# Altium project AJMG 2550XD Silver Jubilee.PrjPcb (part 1 of 2)
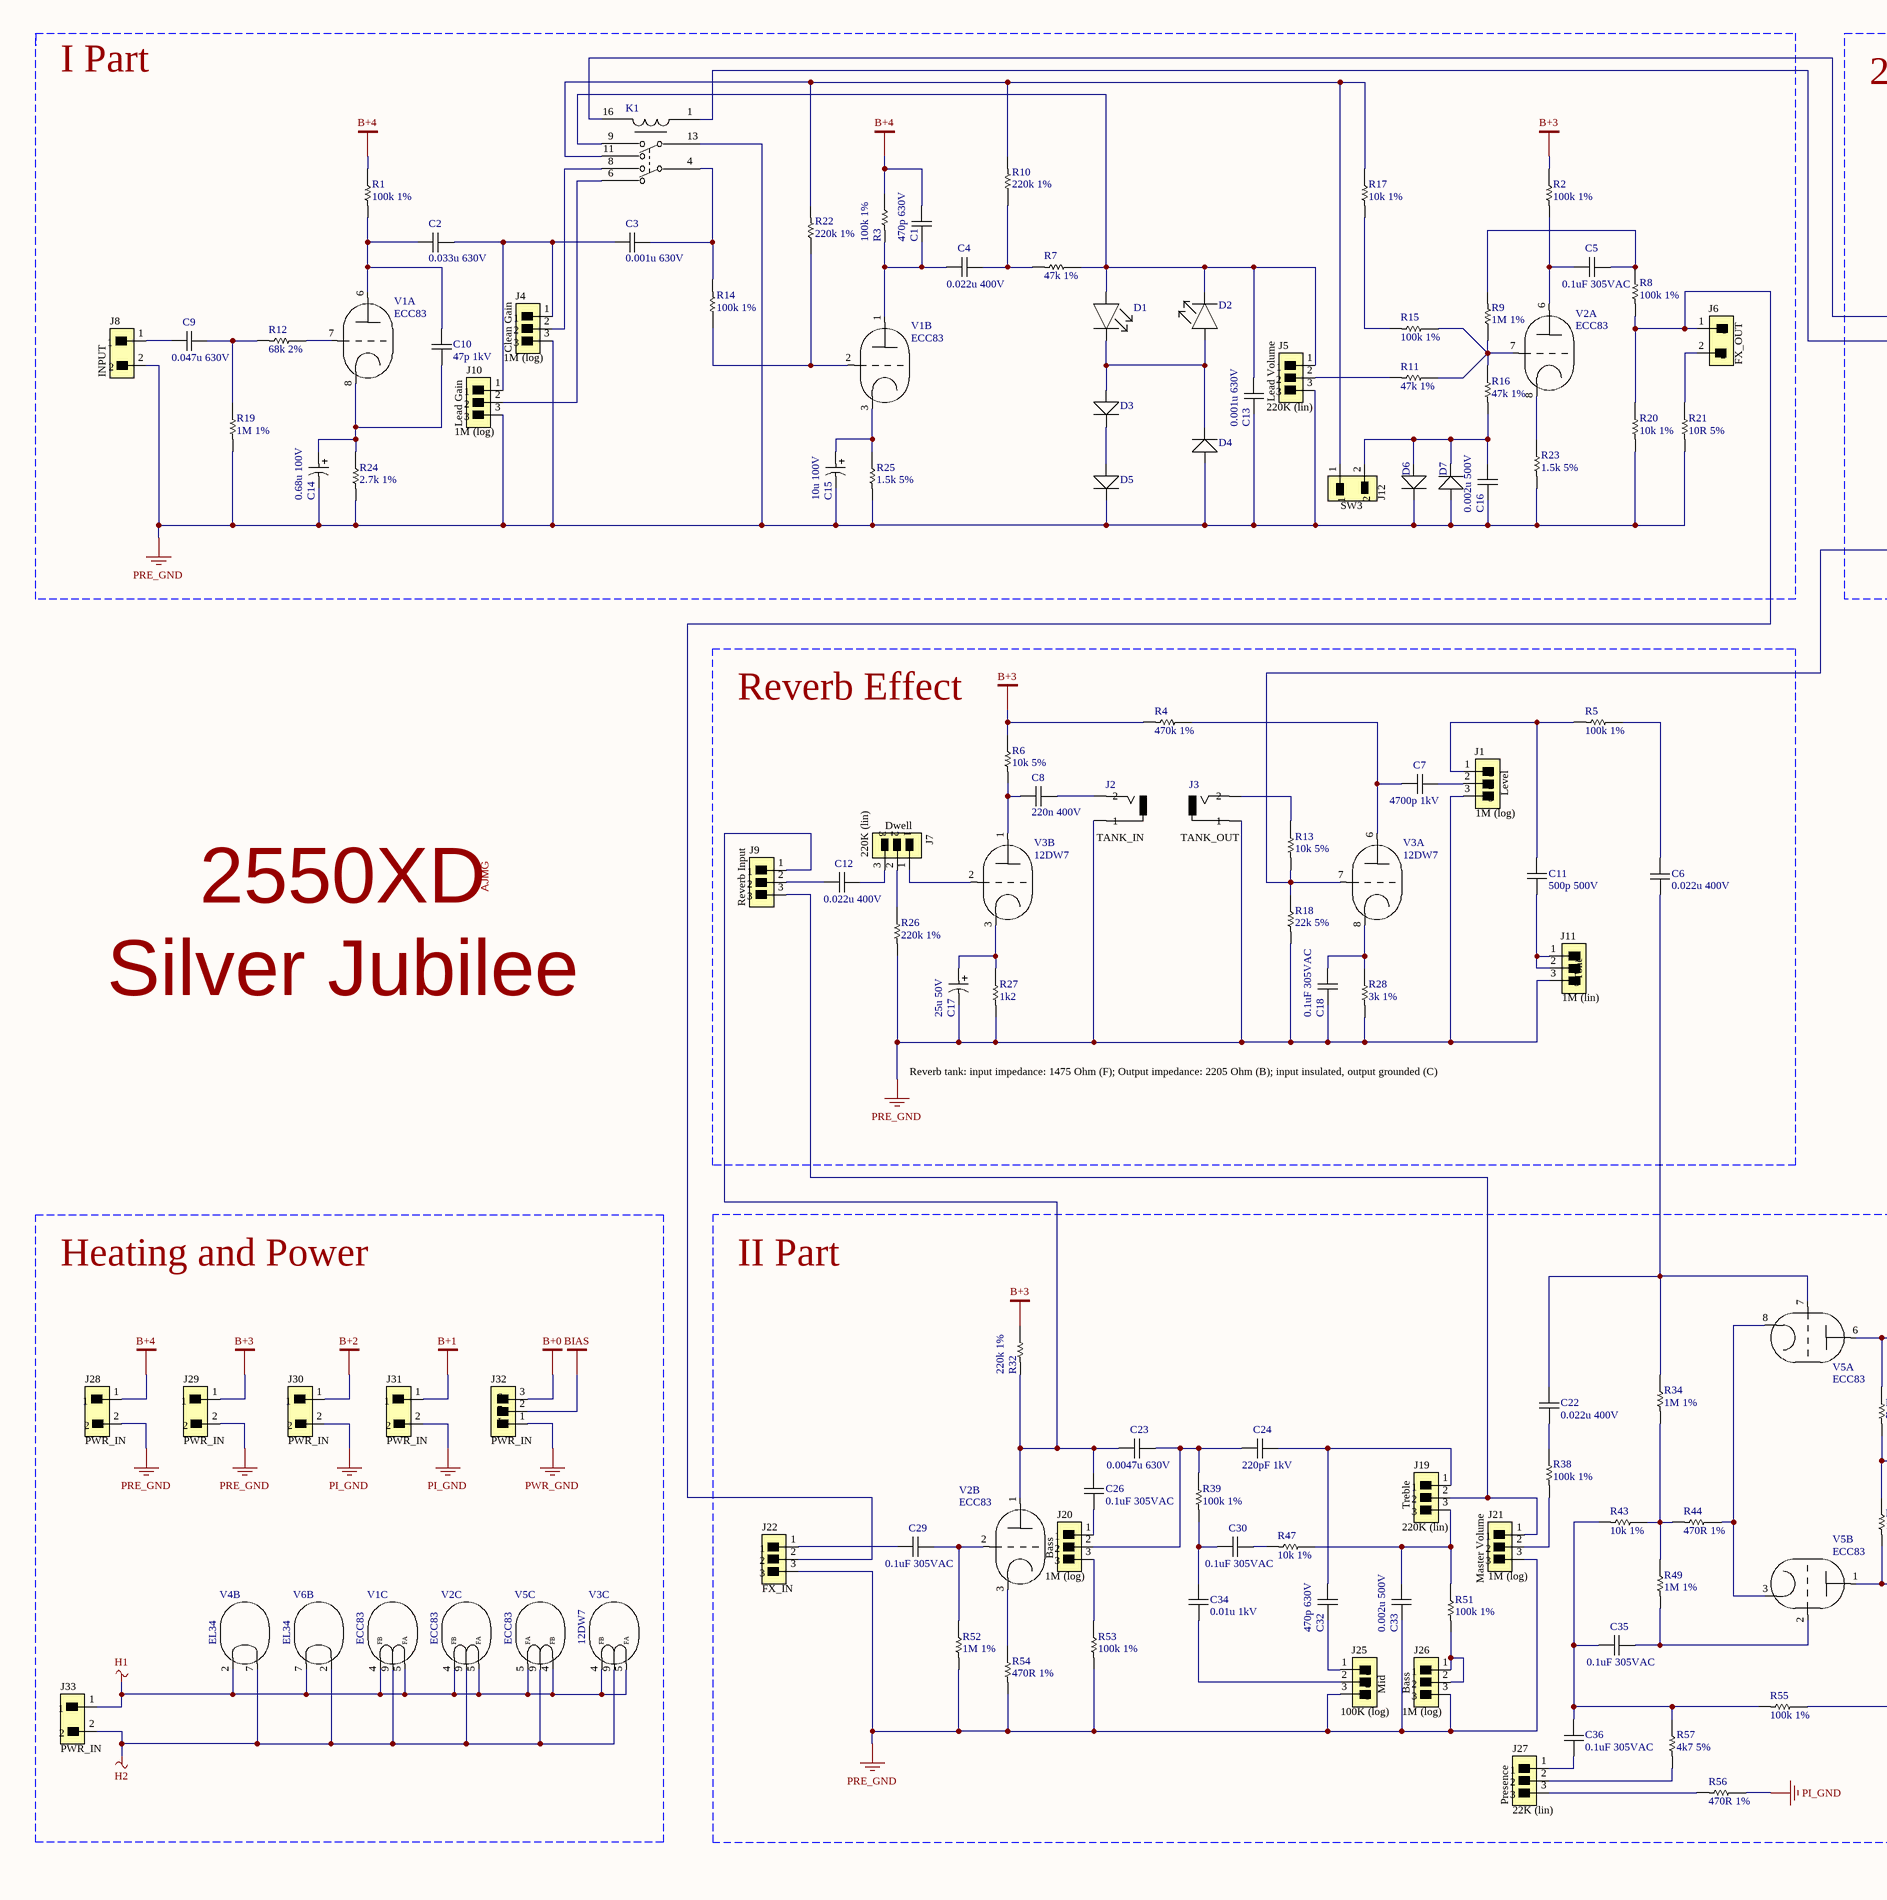
[diagram p0: AJMG 2550XD Silver Jubilee.SchDoc, left]
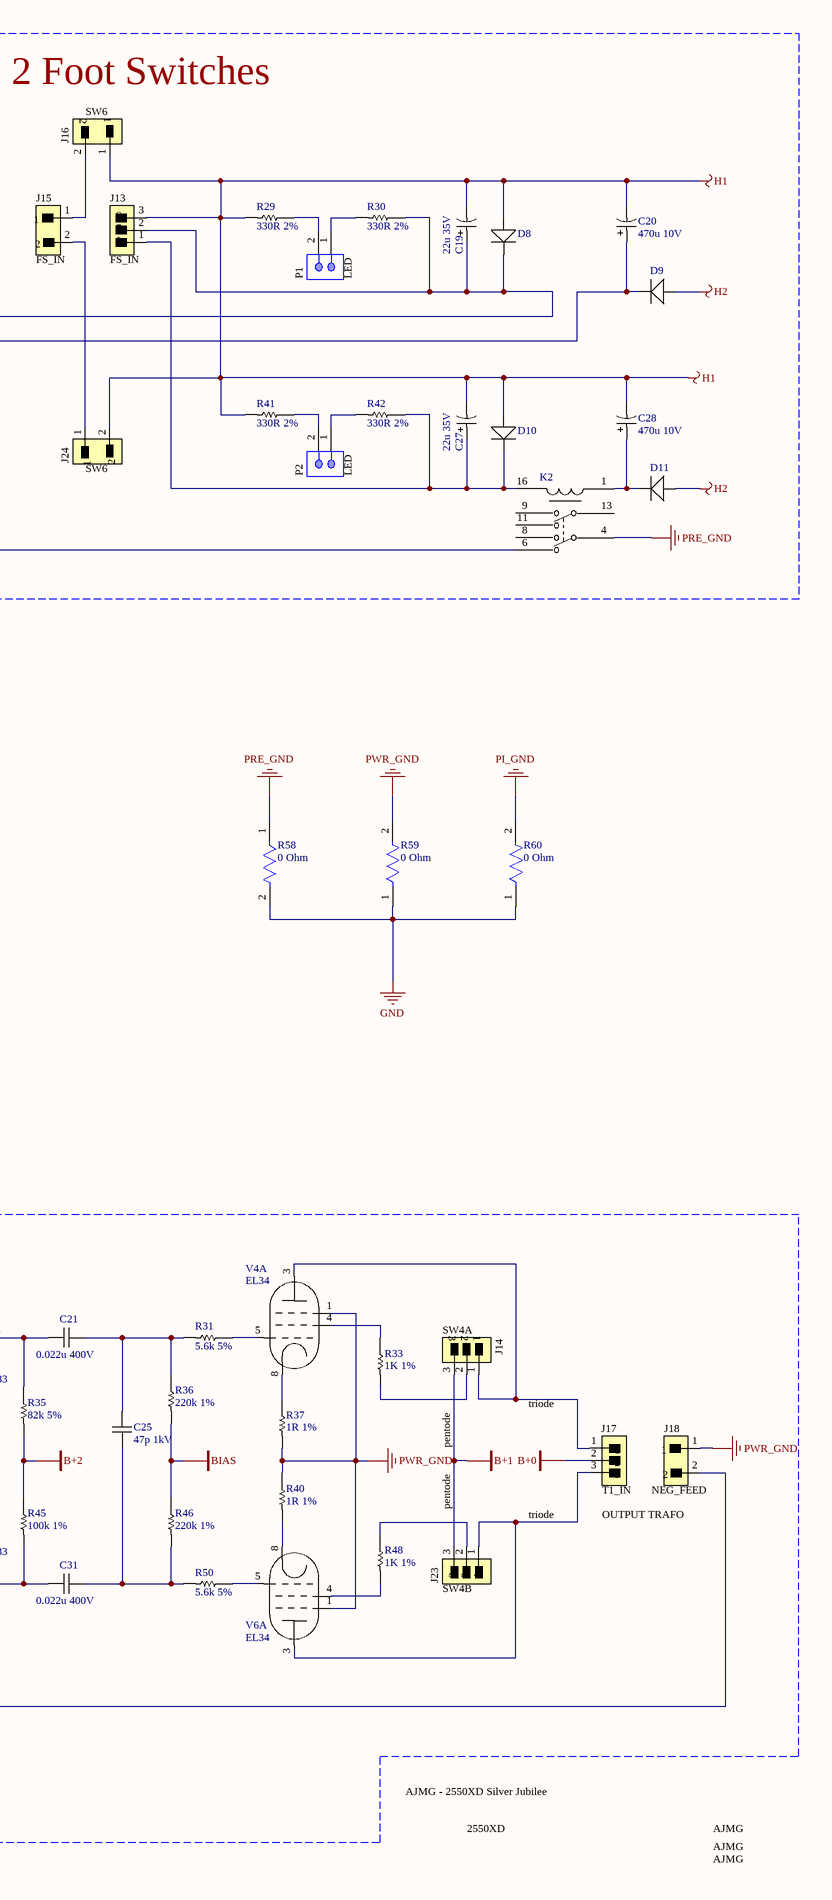
[diagram p1: AJMG 2550XD Silver Jubilee.SchDoc, right]
1 sheet, 150 parts. Net scope: global (net labels, ports and power ports of the same name join across sheets).
Board file: AJMG 2550XD Silver Jubilee.PcbDoc

## Sheet AJMG 2550XD Silver Jubilee.SchDoc
size A2; SheetNumber: 1; SheetTotal: 1

### Parts
C1  470p 630V  [C_THT_5mm_7.2x4.5_NOT_POLARISED]
C2  0.033u 630V  [C_THT_7.5mm_10.5x5_NOT_POLARISED]
C3  0.001u 630V  [C_THT_5mm_7.2x4.5_NOT_POLARISED]
C4  0.022u 400V  [C_THT_10mm_13x5_NOT_POLARISED]
C5  0.1uF 305VAC  [C_THT_10mm_13x5.5_NOT_POLARISED]
C6  0.022u 400V  [C_THT_10mm_13x5_NOT_POLARISED]
C7  4700p 1kV  [C_THT_10mm_13x5_NOT_POLARISED]
C8  220n 400V  [C_THT_15mm_18x5_NOT_POLARISED]
C9  0.047u 630V  [C_THT_7.5mm_10.5x6_NOT_POLARISED]
C10  47p 1kV  [C_THT_15mm_16.3x4.8_NOT_POLARISED]
C11  500p 500V  [C_THT_9mm_16.25x5_NOT_POLARISED]
C12  0.022u 400V  [C_THT_10mm_13x5_NOT_POLARISED]
C13  0.001u 630V  [C_THT_5mm_7.2x4.5_NOT_POLARISED]
C14  0.68u 100V  [C_THT_2mm_D5H11_POLARISED]
C15  10u 100V  [C_THT_2mm_D5H11_POLARISED]
C16  0.002u 500V  [C_THT_8mm_16x5_NOT_POLARISED]
C17  25u 50V  [C_THT_22.5mm_D6.35xH17.45_AXIAL_POLARISED]
C18  0.1uF 305VAC  [C_THT_10mm_13x5.5_NOT_POLARISED]
C19  22u 35V  [C_THT_2mm_D5H11_POLARISED]
C20  470u 10V  [C_THT_2.5mm_D6.3H11_POLARISED]
C21  0.022u 400V  [C_THT_10mm_13x5_NOT_POLARISED]
C22  0.022u 400V  [C_THT_10mm_13x5_NOT_POLARISED]
C23  0.0047u 630V  [C_THT_5mm_7.2x6.5_NOT_POLARISED]
C24  220pF 1kV  [C_THT_7.5mm_10.9x3.8_NOT_POLARISED]
C25  47p 1kV  [C_THT_15mm_16.3x4.8_NOT_POLARISED]
C26  0.1uF 305VAC  [C_THT_10mm_13x5.5_NOT_POLARISED]
C27  22u 35V  [C_THT_2mm_D5H11_POLARISED]
C28  470u 10V  [C_THT_2.5mm_D6.3H11_POLARISED]
C29  0.1uF 305VAC  [C_THT_10mm_13x5.5_NOT_POLARISED]
C30  0.1uF 305VAC  [C_THT_10mm_13x5.5_NOT_POLARISED]
C31  0.022u 400V  [C_THT_10mm_13x5_NOT_POLARISED]
C32  470p 630V  [C_THT_5mm_7.2x4.5_NOT_POLARISED]
C33  0.002u 500V  [C_THT_8mm_16x5_NOT_POLARISED]
C34  0.01u 1kV  [C_THT_7.5mm_10.5x6_NOT_POLARISED]
C35  0.1uF 305VAC  [C_THT_10mm_13x5.5_NOT_POLARISED]
C36  0.1uF 305VAC  [C_THT_10mm_13x5.5_NOT_POLARISED]
D1  LTST-C930CKT  [D_LTST-C930CKT]  (value not drawn)
D2  LTST-C930CKT  [D_LTST-C930CKT]  (value not drawn)
D3  1N4007-T  [D_1N4007-T]  (value not drawn)
D4  1N4007-T  [D_1N4007-T]  (value not drawn)
D5  1N4007-T  [D_1N4007-T]  (value not drawn)
D6  1N4007-T  [D_1N4007-T]  (value not drawn)
D7  1N4007-T  [D_1N4007-T]  (value not drawn)
D8  1N4007-T  [D_1N4007-T]  (value not drawn)
D9  1N4007-T  [D_1N4007-T]  (value not drawn)
D10  1N4007-T  [D_1N4007-T]  (value not drawn)
D11  1N4007-T  [D_1N4007-T]  (value not drawn)
J1  43650-0320  [CONN HEADER VERT 3POS 3MM]  (value not drawn)
J2  RCJ-021  [CONN_CUI_RCJ-021]  (value not drawn)
J3  RCJ-021  [CONN_CUI_RCJ-021]  (value not drawn)
J4  43650-0320  [CONN HEADER VERT 3POS 3MM]  (value not drawn)
J5  43650-0320  [CONN HEADER VERT 3POS 3MM]  (value not drawn)
J6  43650-0229  [CONN HEADER VERT 2POS 3MM]  (value not drawn)
J7  43650-0320  [CONN HEADER VERT 3POS 3MM]  (value not drawn)
J8  43650-0229  [CONN HEADER VERT 2POS 3MM]  (value not drawn)
J9  43650-0320  [CONN HEADER VERT 3POS 3MM]  (value not drawn)
J10  43650-0320  [CONN HEADER VERT 3POS 3MM]  (value not drawn)
J11  43650-0320  [CONN HEADER VERT 3POS 3MM]  (value not drawn)
J12  43650-0229  [CONN HEADER VERT 2POS 3MM]  (value not drawn)
J13  43650-0320  [CONN HEADER VERT 3POS 3MM]  (value not drawn)
J14  43650-0320  [CONN HEADER VERT 3POS 3MM]  (value not drawn)
J15  43650-0229  [CONN HEADER VERT 2POS 3MM]  (value not drawn)
J16  43650-0229  [CONN HEADER VERT 2POS 3MM]  (value not drawn)
J17  43650-0320  [CONN HEADER VERT 3POS 3MM]  (value not drawn)
J18  43650-0229  [CONN HEADER VERT 2POS 3MM]  (value not drawn)
J19  43650-0320  [CONN HEADER VERT 3POS 3MM]  (value not drawn)
J20  43650-0320  [CONN HEADER VERT 3POS 3MM]  (value not drawn)
J21  43650-0320  [CONN HEADER VERT 3POS 3MM]  (value not drawn)
J22  43650-0320  [CONN HEADER VERT 3POS 3MM]  (value not drawn)
J23  43650-0320  [CONN HEADER VERT 3POS 3MM]  (value not drawn)
J24  43650-0229  [CONN HEADER VERT 2POS 3MM]  (value not drawn)
J25  43650-0320  [CONN HEADER VERT 3POS 3MM]  (value not drawn)
J26  43650-0320  [CONN HEADER VERT 3POS 3MM]  (value not drawn)
J27  43650-0320  [CONN HEADER VERT 3POS 3MM]  (value not drawn)
J28  43650-0229  [CONN HEADER VERT 2POS 3MM]  (value not drawn)
J29  43650-0229  [CONN HEADER VERT 2POS 3MM]  (value not drawn)
J30  43650-0229  [CONN HEADER VERT 2POS 3MM]  (value not drawn)
J31  43650-0229  [CONN HEADER VERT 2POS 3MM]  (value not drawn)
J32  43650-0320  [CONN HEADER VERT 3POS 3MM]  (value not drawn)
J33  43650-0229  [CONN HEADER VERT 2POS 3MM]  (value not drawn)
K1  9-1393792-3  [RELAY_V23105A5301A201]  (value not drawn)
K2  9-1393792-3  [RELAY_V23105A5301A201]  (value not drawn)
P1  22-27-2021  [MOLX-22-27-2021_V]  (value not drawn)
P2  22-27-2021  [MOLX-22-27-2021_V]  (value not drawn)
R1  100k 1%  [R_2010]
R2  100k 1%  [R_2010]
R3  100k 1%  [R_2010]
R4  470k 1%  [R_2010]
R5  100k 1%  [R_2010]
R6  10k 5%  [R_2512]
R7  47k 1%  [R_2512]
R8  100k 1%  [R_2010]
R9  1M 1%  [R_2010]
R10  220k 1%  [R_2010]
R11  47k 1%  [R_2512]
R12  68k 2%  [R_MELF_0204]
R13  10k 5%  [R_2512]
R14  100k 1%  [R_2010]
R15  100k 1%  [R_2010]
R16  47k 1%  [R_2512]
R17  10k 1%  [R_2010]
R18  22k 5%  [R_2512]
R19  1M 1%  [R_2010]
R20  10k 1%  [R_2010]
R21  10R 5%  [R_2616_MOLDED]
R22  220k 1%  [R_2010]
R23  1.5k 5%  [R_2512]
R24  2.7k 1%  [R_2512]
R25  1.5k 5%  [R_2512]
R26  220k 1%  [R_2010]
R27  1k2  [R_2512]
R28  3k 1%  [R_2512]
R29  330R 2%  [R_MELF_0207]
R30  330R 2%  [R_MELF_0207]
R31  5.6k 5%  [R_2512]
R32  220k 1%  [R_2010]
R33  1K 1%  [R_3550]
R34  1M 1%  [R_2010]
R35  82k 5%  [R_2512]
R36  220k 1%  [R_2010]
R37  1R 1%  [R_4527_MOLDED]
R38  100k 1%  [R_2010]
R39  100k 1%  [R_2010]
R40  1R 1%  [R_4527_MOLDED]
R41  330R 2%  [R_MELF_0207]
R42  330R 2%  [R_MELF_0207]
R43  10k 1%  [R_2010]
R44  470R 1%  [R_2512]
R45  100k 1%  [R_2010]
R46  220k 1%  [R_2010]
R47  10k 1%  [R_2010]
R48  1K 1%  [R_3550]
R49  1M 1%  [R_2010]
R50  5.6k 5%  [R_2512]
R51  100k 1%  [R_2010]
R52  1M 1%  [R_2010]
R53  100k 1%  [R_2010]
R54  470R 1%  [R_2512]
R55  100k 1%  [R_2010]
R56  470R 1%  [R_2512]
R57  4k7 5%  [R_2512_N]
R58  0 Ohm  [FP-CRCW1210-e3-IPC_B]
R59  0 Ohm  [FP-CRCW1210-e3-IPC_B]
R60  0 Ohm  [FP-CRCW1210-e3-IPC_B]
V1  ECC83  [VT9-PT-2]  (parts A,B,C of 3)
V2  ECC83  [VT9-PT-2]  (parts A,B,C of 3)
V3  12DW7  [VT9-PT-2]  (parts A,B,C of 3)
V4  EL34  [VT8-PT-2]  (parts A,B of 2)
V5  ECC83  [VT9-PT-2]  (parts A,B,C of 3)
V6  EL34  [VT8-PT-2]  (parts A,B of 2)

### Blocks framed on the sheet
2 Foot Switches: C19 C20 C27 C28 D8-D11 J13 J15 J16 J24 K2 P1 P2 R29 R30 R41 R42
Reverb Effect: C6-C8 C11 C12 C17 C18 J1-J3 J7 J9 J11 R4-R6 R13 R18 R26-R28 V3
Heating and Power: J28-J33 V1-V6
II Part: C21-C26 C29-C36 J14 J17-J23 J25-J27 R31-R40 R43-R57 V2 V4-V6

### Nets
B+0: J17.2 J32.3
B+1: J14.3 J23.3 J31.1
B+2: J30.1 R35.1 R45.2
B+3: J29.1 R2.2 R4.1 R6.2 R32.2
B+4: C1.2 J28.1 R1.2 R3.2
BIAS: J32.2 R36.1 R46.2
GND: R58.2 R59.1 R60.1
H1: C19.2(N) C20.2(N) C27.2(N) C28.2(N) D8.1(A) D10.1(A) J13.3 J16.1 J24.2 J33.1 R29.1 R41.1 V1.4(FB) V1.5(FA) V2.4(FB) V2.5(FA) V3.4(FB) V3.5(FA) V4.2(F) V5.4(FB) V5.5(FA) V6.7(F)
H2: D9.1(A) D11.1(A) J33.2 V1.9(FC) V2.9(FC) V3.9(FC) V4.7(F) V5.9(FC) V6.2(F)
PI_GND: J30.2 J31.2 R56.2 R60.2
PRE_GND: C13.1 C14.2(N) C15.2(N) C16.1 C17.2(N) C18.1 C33.1 D4.1(A) D5.2(C) D6.2(C) D7.1(A) J1.3 J2.1 J3.1 J4.3 J5.3 J8.2 J10.3 J11.3 J21.3 J22.3 J25.3 J26.3 J28.2 J29.2 K1.13 K2.4 R18.1 R19.1 R20.1 R21.1 R23.1 R24.1 R25.1 R26.1 R27.1 R28.1 R52.1 R53.1 R54.1 R58.1
PWR_GND: J18.1 J32.1 R37.1 R40.2 R59.2 V4.1(G3) V6.1(G3)
NetC1_1: C1.1 C4.1 R3.1 V1.1(A2)
NetC2_1: C2.1 C10.2 R1.1 V1.6(A1)
NetC2_2: C2.2 C3.1 J4.1 J10.1
NetC3_2: C3.2 K1.4 R14.1
NetC4_2: C4.2 R7.1 R10.2
NetC5_1: C5.1 R2.1 V2.6(A1)
NetC5_2: C5.2 R8.2 R9.1
NetC6_1: C6.1 R5.2
NetC6_2: C6.2 C22.1 R34.2 V5.7(G1)
NetC7_1: C7.1 R4.2 V3.6(A1)
NetC7_2: C7.2 J1.2
NetC8_1: C8.1 R6.1 V3.1(A2)
NetC8_2: C8.2 J2.2
NetC9_1: C9.1 J8.1
NetC9_2: C9.2 R12.1 R19.2
NetC10_1: C10.1 C14.1(P) R24.2 V1.8(K1)
NetC11_1: C11.1 J11.1 J11.2
NetC11_2: C11.2 J1.1 R5.1
NetC12_1: C12.1 J7.3
NetC12_2: C12.2 J9.2
NetC13_2: C13.2 D1.1(A) D2.2(C) J5.1 K1.9 R7.2
NetC15_1: C15.1(P) R25.2 V1.3(K2)
NetC16_2: C16.2 D6.1(A) D7.2(C) J12.2 R16.1
NetC17_1: C17.1(P) R27.2 V3.3(K2)
NetC18_2: C18.2 R28.2 V3.8(K1)
NetC19_1: C19.1(P) D8.2(C) J13.2 K1.16 R30.2
NetC20_1: C20.1(P) D9.2(C) K1.1
NetC21_1: C21.1 R35.2 V5.6(A1)
NetC21_2: C21.2 C25.2 R31.1 R36.2
NetC22_2: C22.2 R38.2
NetC23_1: C23.1 C26.2 J9.1 R32.1 V2.1(A2)
NetC23_2: C23.2 C24.1 J20.2 R39.2
NetC24_2: C24.2 C32.2 J19.1
NetC25_1: C25.1 C31.2 R46.1 R50.1
NetC26_1: C26.1 J20.1
NetC27_1: C27.1(P) D10.2(C) J13.1 K2.16 R42.2
NetC28_1: C28.1(P) D11.2(C) K2.1
NetC29_1: C29.1 J22.1
NetC29_2: C29.2 R52.2 V2.2(G2)
NetC30_1: C30.1 C34.2 R39.1
NetC30_2: C30.2 R47.1
NetC31_1: C31.1 R45.1 V5.1(A2)
NetC32_1: C32.1 J25.1
NetC33_2: C33.2 J19.3 R47.2 R51.2
NetC34_1: C34.1 J25.2
NetC35_1: C35.1 C36.1 R43.1 R55.1 R57.1
NetC35_2: C35.2 R49.1 V5.2(G2)
NetC36_2: C36.2 J27.1
NetD1_2: D1.2(C) D2.1(A) D3.1(A) D4.2(C)
NetD3_2: D3.2(C) D5.1(A)
NetJ3_2: J3.2 R13.2
NetJ4_2: J4.2 K1.8
NetJ5_2: J5.2 R11.1
NetJ6_1: J6.1 J22.2 R8.1 R20.2
NetJ6_2: J6.2 R21.2
NetJ7_1: J7.1 V3.2(G2)
NetJ7_2: J7.2 R26.2
NetJ9_3: J9.3 J19.2 J21.1
NetJ10_2: J10.2 K1.6
NetJ12_1: J12.1 K1.11 R10.1 R17.2 R22.1
NetJ14_1: J14.1 J17.1 V4.3(A)
NetJ14_2: J14.2 R33.1
NetJ15_1: J15.1 J16.2
NetJ15_2: J15.2 J24.1
NetJ17_3: J17.3 J23.1 V6.3(A)
NetJ18_2: J18.2 R55.2
NetJ20_3: J20.3 R53.2
NetJ21_2: J21.2 R38.1
NetJ23_2: J23.2 R48.2
NetJ26_1: J26.1 J26.2 R51.1
NetJ27_2: J27.2 R57.2
NetJ27_3: J27.3 R56.1
NetK2_6: K2.6 R13.1 R18.2 V3.7(G1)
NetP1_1: P1.1 R30.1
NetP1_2: P1.2 R29.2
NetP2_1: P2.1 R42.1
NetP2_2: P2.2 R41.2
NetR9_2: R9.2 R11.2 R15.2 R16.2 V2.7(G1)
NetR12_2: R12.2 V1.7(G1)
NetR14_2: R14.2 R22.2 V1.2(G2)
NetR15_1: R15.1 R17.1
NetR23_2: R23.2 V2.8(K1)
NetR31_2: R31.2 V4.5(G1)
NetR33_2: R33.2 V4.4(G2)
NetR34_1: R34.1 R43.2 R44.1 R49.2
NetR37_2: R37.2 V4.8(K)
NetR40_1: R40.1 V6.8(K)
NetR44_2: R44.2 V5.3(K2) V5.8(K1)
NetR48_1: R48.1 V6.4(G2)
NetR50_2: R50.2 V6.5(G1)
NetR54_2: R54.2 V2.3(K2)

Not connected (* = marked no-connect by the designer): K2 8 9 11 13

### Notes on the sheet
- I Part
- (near J16) SW6
- (near J15) FS_IN
- (near J13) FS_IN
- (near P1) LED
- (near J8) INPUT
- (near J4) 1M (log)
- Clean Gain
- (near J6) FX_OUT
- (near J10) 1M (log)
- Lead Gain
- 220K (lin)
- (near C13) Lead Volume
- (near J12) SW3
- (near J24) SW6
- (near P2) LED
- (near J1) 1M (log)
- (near J1) Level
- 2550XD
- AJMG
- (near J7) 220K (lin)
- (near J7) Dwell
- (near J2) TANK_IN
- (near J3) TANK_OUT
- (near J9) Reverb Input
- Silver Jubilee
- (near J11) 1M (lin)
- (near J11) Tone
- Reverb tank: input impedance: 1475 Ohm (F); Output impedance: 2205 Ohm (B); input insulated, output grounded (C)
- (near J14) SW4A
- triode
- (near J28) PWR_IN
- (near J29) PWR_IN
- (near J30) PWR_IN
- (near J31) PWR_IN
- (near J32) PWR_IN
- pentode
- (near J17) T1_IN
- (near J18) NEG_FEED
- Bass
- (near J19) 220K (lin)
- (near J19) Treble
- OUTPUT TRAFO
- (near J22) FX_IN
- (near J20) 1M (log)
- (near J21) 1M (log)
- Master Volume
- (near J23) SW4B
- (near J25) 100K (log)
- (near J25) Mid
- (near J26) 1M (log)
- (near J26) Bass
- (near J33) PWR_IN
- (near J27) Presence
- AJMG - 2550XD Silver Jubilee
- (near J27) 22K (lin)